# EAGLE design Borealis_DMX&Pixel (EAGLE 7.6.0)
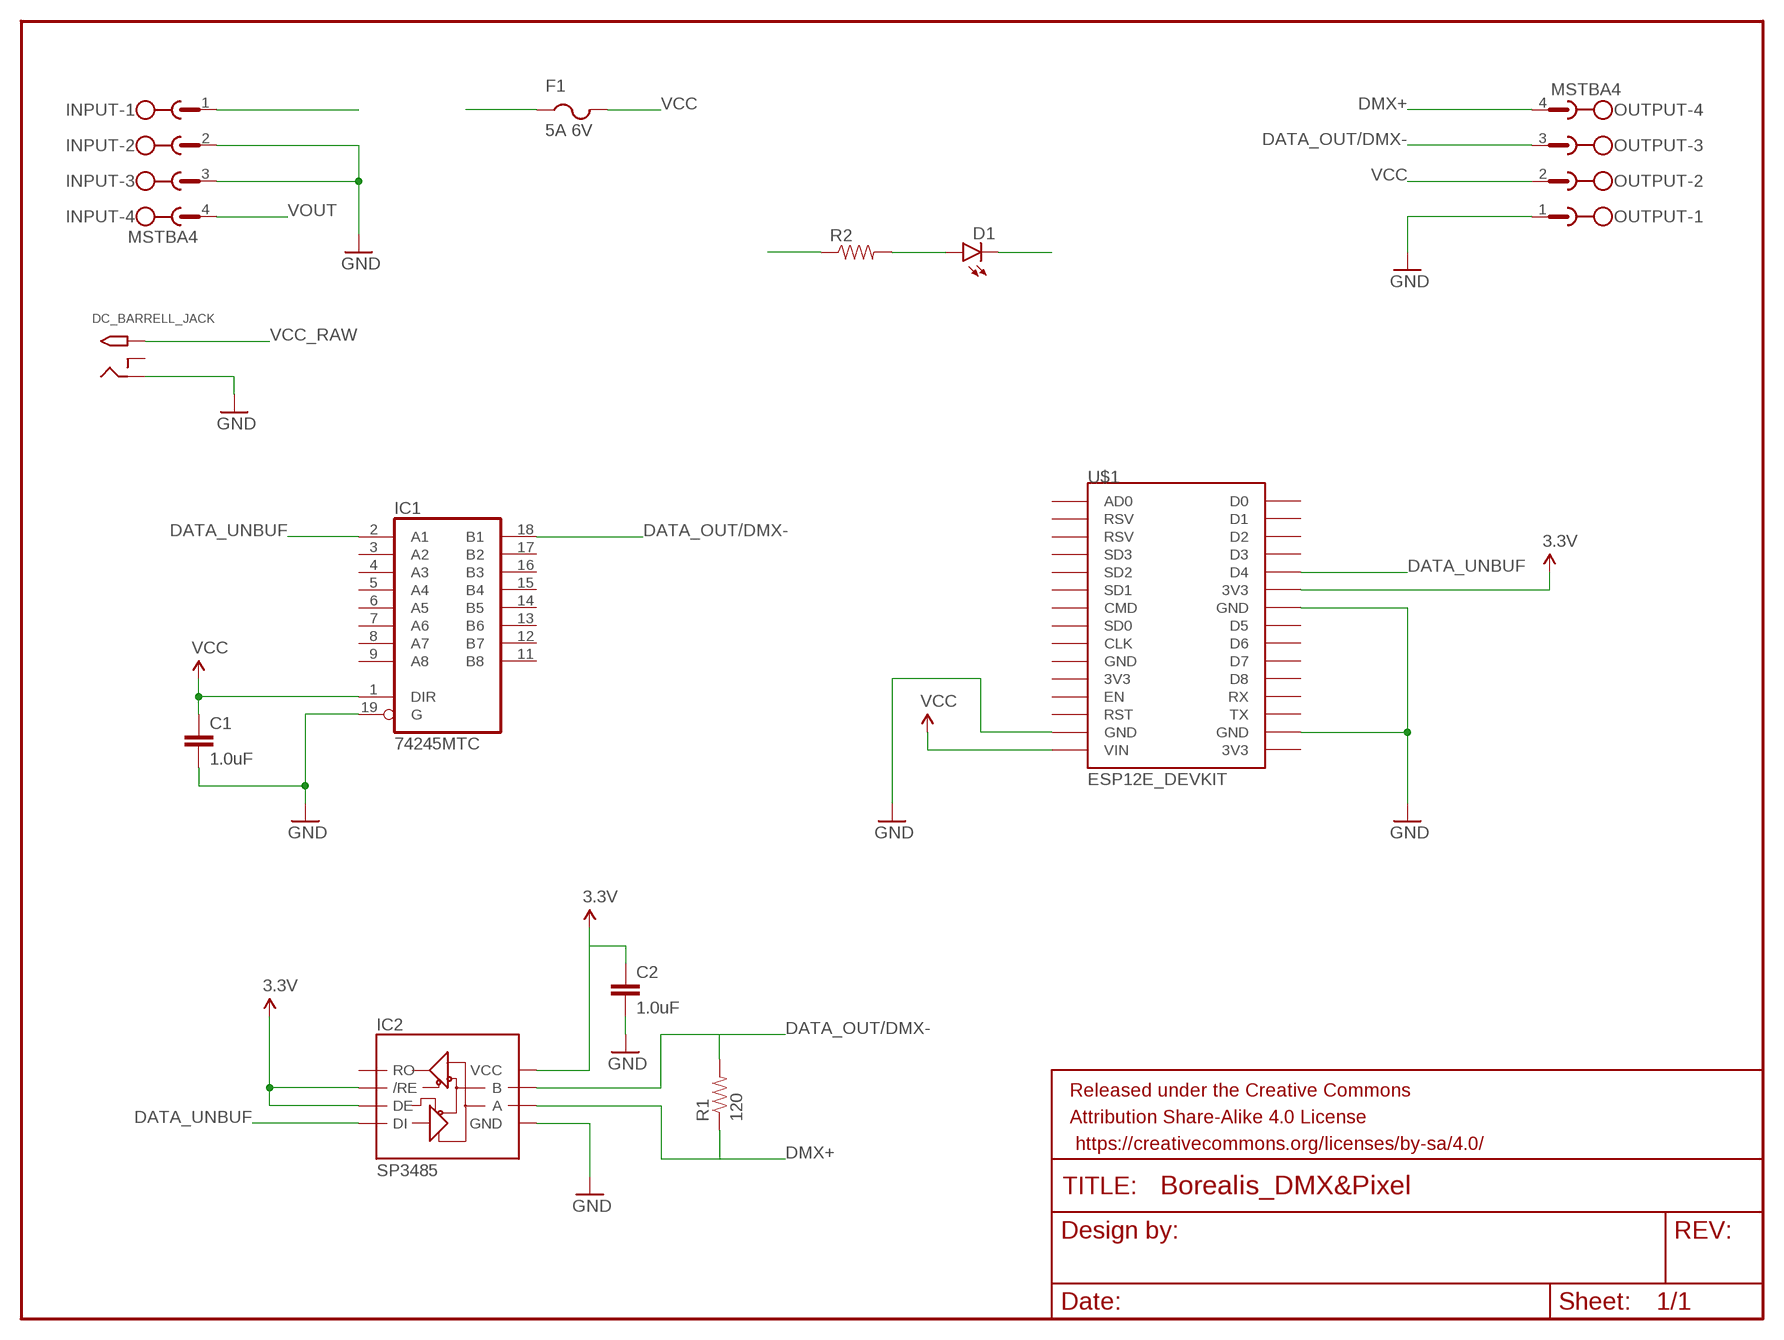
[diagram p0: schematic, sheet 1]

## Parts
C1  1.0uF  1.0UF-16V-10%(0603)  [0603-CAP]
C2  1.0uF  1.0UF-16V-10%(0603)  [0603-CAP]
D1  LED1206-BOTTOM  [LED-1206-BOTTOM]
DC_BARRELL_JACK  2.1MMJACKTHM  [PJ-102A]
F1  5A 6V  PTCFUSE-1206  [R1206]
FRAME1  FRAME-LETTERNO_PACKAGE  [DUMMY]
IC1  74245MTC  [SSOP20]
IC2  SP3485  RS485SOIC  [SO08]
INPUT  MSTBA4  [MSTBA4]
OUTPUT  MSTBA4  [MSTBA4]
R1  120  RESISTOR0603  [0603-RES]
R2  RESISTOR0603-RES  [0603-RES]
U$1  ESP12E_DEVKIT  [DEV_LAYOUT]

## Nets
3.3V: C2.1 IC2.2(/RE) IC2.3(DE) IC2.8(VCC) U$1.3V3@1(3V3)
DATA_OUT/DMX-: IC1.18(B1) IC2.7(B) OUTPUT.3 R1.2
DATA_UNBUF: IC1.2(A1) IC2.4(DI) U$1.D4
DMX+: IC2.6(A) OUTPUT.4 R1.1
GND: C1.2 C2.2 D1.C DC_BARRELL_JACK.RING IC1.19(G) IC2.5(GND) INPUT.2 INPUT.3 OUTPUT.1 U$1.GND@1(GND) U$1.GND@2(GND) U$1.GND@3(GND)
LED_PWR: D1.A R2.2
VCC: C1.1 F1.2 IC1.1(DIR) OUTPUT.2 R2.1 U$1.VIN
VCC_RAW: DC_BARRELL_JACK.TIP F1.1 INPUT.1
VOUT: INPUT.4
Unconnected: DC_BARRELL_JACK.RING_SW IC1.3(A2) IC1.4(A3) IC1.5(A4) IC1.6(A5) IC1.7(A6) IC1.8(A7) IC1.9(A8) IC1.11(B8) IC1.12(B7) IC1.13(B6) IC1.14(B5) IC1.15(B4) IC1.16(B3) IC1.17(B2) IC2.1(RO) U$1.3V3@0(3V3) U$1.3V3@2(3V3) U$1.AD0 U$1.CLK U$1.CMD U$1.D0 U$1.D1 U$1.D2 U$1.D3 U$1.D5 U$1.D6 U$1.D7 U$1.D8 U$1.EN U$1.GND@0(GND) U$1.RST U$1.RSV@0(RSV) U$1.RSV@1(RSV) U$1.RX U$1.SD0 U$1.SD1 U$1.SD2 U$1.SD3 U$1.TX

## Power pins joined to a net without a drawn wire
GND: IC1.10(GND)
VCC: IC1.20(VCC)

## Library data of the parts
C1 C2 = SparkFun-Capacitors:1.0UF-16V-10%(0603): CAP-00868; PROD_ID: CAP-00868
D1 = SparkFun-LED:LED: LEDs Standard schematic elements and footprints for 5mm, 3mm, 1206, and 0603 sized LEDs. 5mm - Spark Fun Electronics SKU : COM-00529 (and others)
DC_BARRELL_JACK = adafruit:2.1MMJACK: 2.1mm x 5.5mm THM DC jack with internal switch. Digikey part #PJ-102A, 4UCON part #05537 2.1mm x 5.5mm SMT DC jack with internal switch. Digikey part #PJ-002A-SMT, 4UCON part #03267 By microbuilder.eu & adafruit.com
F1 = adafruit:PTCFUSE: PTC fuses, resettable thermistors
FRAME1 = SparkFun-Aesthetics:FRAME-LETTER: Schematic Frame Standard 8.5x11 US Letter frame; DESIGNER: Nobody; VERSION: v01
IC1 = adafruit:74*245: Octal BUS TRANSCEIVER, 3-state
IC2 = SparkFun-DigitalIC:RS485: RS485 transceiver
INPUT OUTPUT = con-phoenix-508:MSTBA4: PHOENIX; MF: FARNELL; MPN: 1757268; OC_FARNELL: 3705195; OC_NEWARK: 71C4163
R1 = SparkFun-Resistors:RESISTOR: Resistor Basic schematic elements and footprints for 0603, 1206, and PTH resistors.
R2 = SparkFun-Passives:RESISTOR: Resistor Basic schematic elements and footprints for 0603, 1206, and PTH resistors.
U$1 = ESP12E_DEVKIT:ESP12E_DEVKIT: ESP12E DEVKIT BOARD

## Board
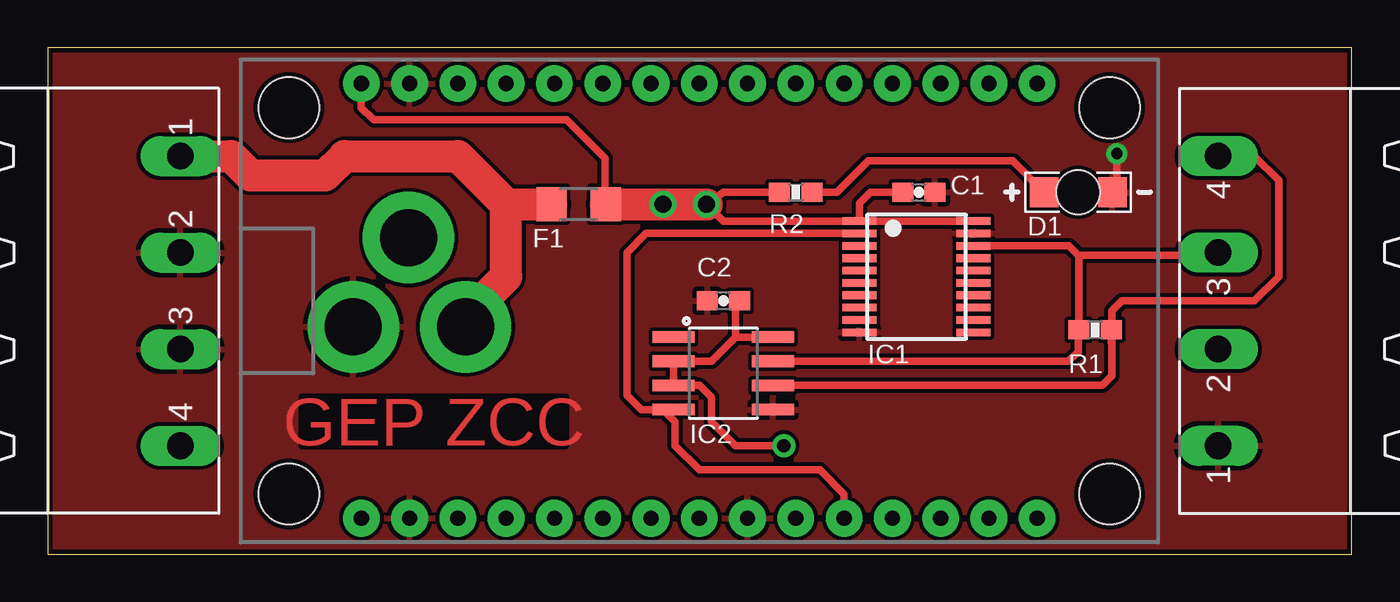
[diagram p1: board, top side]
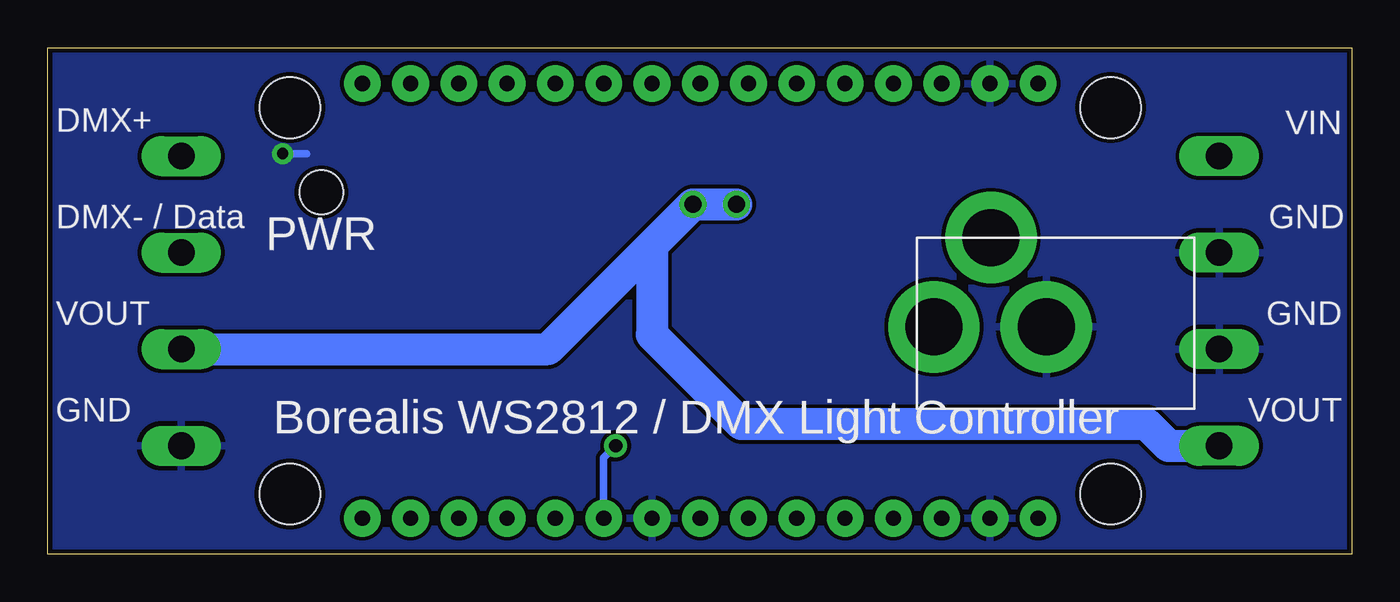
[diagram p2: board, bottom side, seen from below]

Size 68.63 x 26.66 mm. Coordinates in mm from the lower left corner, seen from the top.
Outline: 0,0 68.63,0 68.63,26.66 0,26.66 0,0
Copper layers (1*16): Top 0.035mm / dielectric 1.5mm / Bottom 0.035mm
Design rules "SparkFun": minimum track width 8mil, minimum drill 20mil, track to track 8mil, track to pad 8mil, pad to pad 8mil, via to via 8mil, smd to smd 8mil, copper to edge 10mil, drill to drill 8mil, minimum pad ring 12mil, minimum via ring 10mil, stop-mask expansion 4mil, vias tented up to drill 25mil, thermal gap 10mil

### Footprints (pad centres in the part's own frame; a part is rotated, then mirrored left to right if it is on the bottom)
0603-CAP = smd 1.1 x 1: 1 -0.85,0; 2 0.85,0
LED-1206-BOTTOM = smd 1.5 x 1.6: A -1.8,0; C 1.8,0 | hole 2.3: 0,0
PJ-102A = drill 3 pad 4.8: RING 0.1,-3.39; RING_SW -4.6,-6.29; TIP 0.1,-9.29
R1206 = smd 1.6 x 1.803: 1 -1.422,0; 2 1.422,0
SSOP20 = smd 0.4 x 1.8: 1 -2.925,-3; 2 -2.275,-3; 3 -1.625,-3; 4 -0.975,-3; 5 -0.325,-3; 6 0.325,-3; 7 0.975,-3; 8 1.625,-3; 9 2.275,-3; 10 2.925,-3; 11 2.925,3; 12 2.275,3; 13 1.625,3; 14 0.975,3; 15 0.325,3; 16 -0.325,3; 17 -0.975,3; 18 -1.625,3; 19 -2.275,3; 20 -2.925,3
SO08 = smd 0.61 x 2.21: 1 -1.905,-2.616; 2 -0.635,-2.616; 3 0.635,-2.616; 4 1.905,-2.616; 5 1.905,2.616; 6 0.635,2.616; 7 -0.635,2.616; 8 -1.905,2.616
MSTBA4 = drill 1.397 long: 1 -7.62,5.08; 2 -2.54,5.08; 3 2.54,5.08; 4 7.62,5.08
0603-RES = smd 1.1 x 1: 1 -0.85,0; 2 0.85,0
DEV_LAYOUT = drill 0.8 pad 1.93: 3V3@0 -11.43,-6.35; 3V3@1 11.43,6.35; 3V3@2 11.43,-16.51; AD0 -11.43,19.05; CLK -11.43,-1.27; CMD -11.43,3.81; D0 11.43,19.05; D1 11.43,16.51; D2 11.43,13.97; D3 11.43,11.43; D4 11.43,8.89; D5 11.43,1.27; D6 11.43,-1.27; D7 11.43,-3.81; D8 11.43,-6.35; EN -11.43,-8.89; GND@0 -11.43,-3.81; GND@1 -11.43,-13.97; GND@2 11.43,3.81; GND@3 11.43,-13.97; RST -11.43,-11.43; RSV@0 -11.43,16.51; RSV@1 -11.43,13.97; RX 11.43,-8.89; SD0 -11.43,1.27; SD1 -11.43,6.35; SD2 -11.43,8.89; SD3 -11.43,11.43; TX 11.43,-11.43; VIN -11.43,-16.51 | hole 3.2: -10.16,22.86; 10.16,22.86; 10.16,-20.32; -10.16,-20.32

### Placement (x,y rotation side)
C1  45.85,19.05 0 top
C2  35.56,13.34 180 top
D1  54.23,19.05 0 top
DC_BARRELL_JACK  12.7,12.06 270 bottom
F1  27.94,18.41 0 top
FRAME1  -7.49,-6.22 0 top  (outside the outline)
IC1  45.72,14.61 270 top
IC2  35.56,9.53 270 top
INPUT  1.91,13.34 270 top
OUTPUT  66.67,13.34 90 top
R1  55.12,11.81 180 top
R2  39.37,19.05 0 top
U$1  33.02,13.34 270 top

### Tracks (layer width: path | path; a pad name or v marks a point on that pad's centre or on a via)
3.3V  (via drill 0.7)
  Top 0.406: IC2.8 36.2,11.43 | 36.2,11.43 34.92,10.16 IC2.2 IC2.3 34.29,8.89 34.92,8.26 34.92,6.99 36.2,5.71 v38.73,5.71 | 36.2,11.43 36.2,13.12 C2.1
  Bottom 0.406: U$1.3V3@1 39.37,5.08 v38.73,5.71
DATA_OUT/DMX-
  Top 0.406: IC1.18 53.75,16.23 54.23,15.75 | 54.23,15.75 61.47,15.75 OUTPUT.3 | 54.23,15.75 54.27,15.71 R1.2 54.23,11.77 54.23,10.67 53.72,10.16 IC2.7
DATA_UNBUF
  Top 0.406: U$1.D4 41.91,3.17 40.64,4.45 34.29,4.45 33.02,5.71 33.02,6.99 32.38,7.62 | IC1.2 31.48,16.88 30.48,15.88 30.48,8.38 31.24,7.62 32.38,7.62 | 32.38,7.62 IC2.4
DMX+
  Top 0.406: OUTPUT.4 63.5,20.95 64.77,19.68 64.77,14.61 63.5,13.34 56.52,13.34 56.01,12.83 56.01,10.25 | IC2.6 55.5,8.89 56.01,9.4 56.01,10.25 | 56.01,10.25 R1.1
GND  (via drill 0.6)
  Top 0.406: D1.C 56.26,18.82 v56.26,21.08
  Bottom 0.406: v56.26,21.08 54.99,21.08
  pour Bottom: 71.12,28.57 -2.54,28.57 -2.54,-1.91 71.12,-1.91
  pour Top: -1.27,28.57 71.12,28.57 71.12,-3.17 -1.27,-3.17
LED_PWR
  Top 0.406: D1.A 50.78,20.7 43.18,20.7 41.53,19.05 R2.2
VCC  (via drill 0.9)
  Top 0.406: U$1.VIN 16.51,23.49 17.14,22.86 27.3,22.86 29.34,20.83 29.34,18.44 F1.2 | IC1.1 | IC1.20 IC1.1 | IC1.1 42.72,17.57 | C1.1 43.31,19.05 42.72,18.46 42.72,17.57 | 34.92,18.41 v34.67,18.41 | R2.1 35.56,19.05 v34.67,18.41 | 42.72,17.57 42.67,17.53 35.56,17.53 v34.67,18.41
  Top 1.676: F1.2 v32.38,18.41 v34.67,18.41
  Bottom 1.676: v32.38,18.41 v34.67,18.41 36.83,16.26 | OUTPUT.2 42.29,10.79 36.83,16.26 | 36.83,16.26 36.83,11.56 32.13,6.86 10.79,6.86 9.65,5.71 6.99,5.71
VCC_RAW
  Top 0.406: DC_BARRELL_JACK.TIP 21.99,12.46
  Top 1.676: 24.13,18.41 21.59,20.95 15.62,20.95 14.61,19.94 10.67,19.94 9.65,20.95 INPUT.1 | 24.13,18.41 F1.1 | 21.99,12.46 24.13,14.61 24.13,18.41

### Text on the board
Top: GEP ZCC
bPlace: VIN | DMX+ | GND | DMX- / Data | GND | VOUT | VOUT | GND
bNames: PWR | Borealis WS2812 / DMX Light Controller